# Altium project TKHTN.PrjPcb
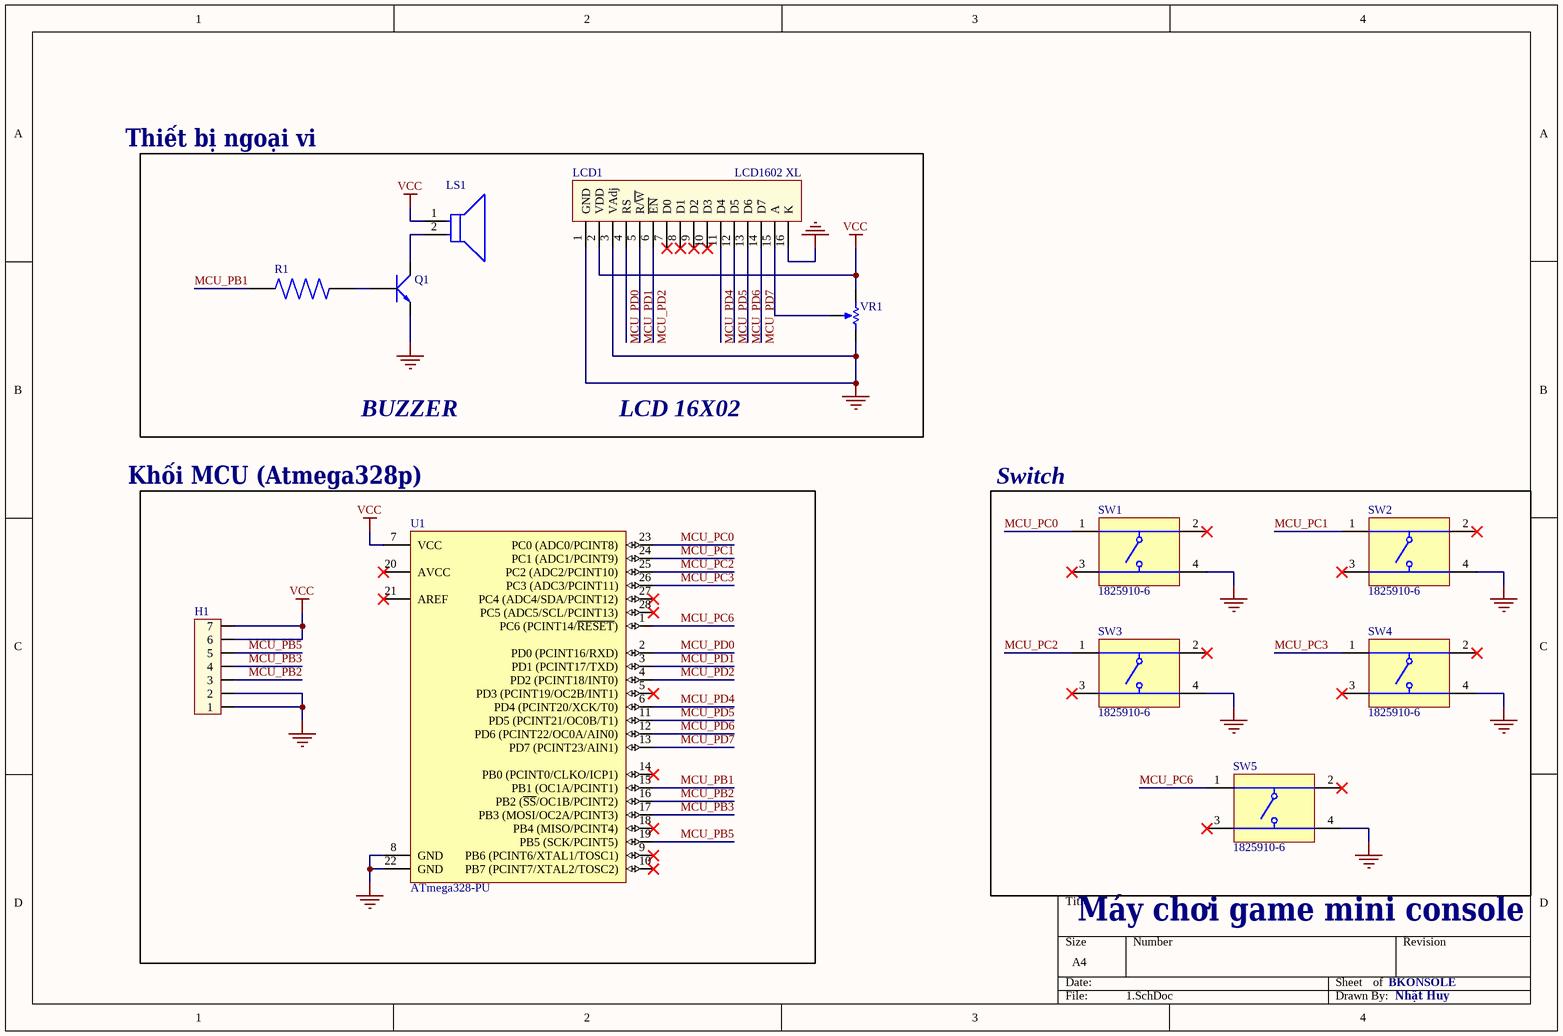
[diagram p0: 1.SchDoc]
1 sheet, 12 parts. Net scope: global (net labels, ports and power ports of the same name join across sheets).
Board file: 1.PcbDoc

## Sheet 1.SchDoc: Máy chơi game mini console
size A4; Author: BKONSOLE; DrawnBy: Nhật Huy; SheetNumber: 1; SheetTotal: 1

### Parts
H1  Header 7P 2.54 Duc Thang  [XH2.54M-7]  (value not drawn)
LCD1  LCD1602 XL  [LCD1602]
LS1  SD1614TT-A5ME  [FP-SD1614TT-A5ME-MFG]  (value not drawn)
Q1  C1815  [TO92]  (value not drawn)
R1  MFR-25FBF52-1K  [RESAD1100W55L680D260]  (value not drawn)
SW1  1825910-6  [TECO-1825910-6_V]
SW2  1825910-6  [TECO-1825910-6_V]
SW3  1825910-6  [TECO-1825910-6_V]
SW4  1825910-6  [TECO-1825910-6_V]
SW5  1825910-6  [TECO-1825910-6_V]
U1  ATmega328-PU  [28P3]
VR1  3006P-1-201ZLF  [BOUR-3006P-3_V]  (value not drawn)

### Blocks framed on the sheet
Khối MCU (Atmega328p): H1 U1
Switch: SW1-SW5

### Nets
GND: H1.1 H1.2 LCD1.1(GND) LCD1.3(VAdj) LCD1.16(K) Q1.1(E) SW1.4 SW2.4 SW3.4 SW4.4 SW5.4 U1.8(GND) U1.22(GND) VR1.1(CCW)
VCC: H1.6 H1.7 LCD1.2(VDD) LS1.1(C) U1.7(VCC) VR1.3(CW)
MCU_PB1: R1.1 U1.15(PB1_(OC1A/PCINT1))
MCU_PB2: H1.3 U1.16(PB2_(~{SS}/OC1B/PCINT2))
MCU_PB3: H1.4 U1.17(PB3_(MOSI/OC2A/PCINT3))
MCU_PB5: H1.5 U1.19(PB5_(SCK/PCINT5))
MCU_PC0: SW1.1 U1.23(PC0_(ADC0/PCINT8))
MCU_PC1: SW2.1 U1.24(PC1_(ADC1/PCINT9))
MCU_PC2: SW3.1 U1.25(PC2_(ADC2/PCINT10))
MCU_PC3: SW4.1 U1.26(PC3_(ADC3/PCINT11))
MCU_PC6: SW5.1 U1.1(PC6_(PCINT14/~{RESET}))
MCU_PD0: LCD1.4(RS) U1.2(PD0_(PCINT16/RXD))
MCU_PD1: LCD1.5(R/~{W}) U1.3(PD1_(PCINT17/TXD))
MCU_PD2: LCD1.6(~{EN}) U1.4(PD2_(PCINT18/INT0))
MCU_PD4: LCD1.11(D4) U1.6(PD4_(PCINT20/XCK/T0))
MCU_PD5: LCD1.12(D5) U1.11(PD5_(PCINT21/OC0B/T1))
MCU_PD6: LCD1.13(D6) U1.12(PD6_(PCINT22/OC0A/AIN0))
MCU_PD7: LCD1.14(D7) U1.13(PD7_(PCINT23/AIN1))
NetLCD1_15: LCD1.15(A) VR1.2(WIPER)
NetLS1_2: LS1.2(A) Q1.2(C)
NetQ1_3: Q1.3(B) R1.2

Not connected (* = marked no-connect by the designer): LCD1 7(D0)* 8(D1)* 9(D2)* 10(D3)*; SW1 2* 3*; SW2 2* 3*; SW3 2* 3*; SW4 2* 3*; SW5 2* 3*; U1 5(PD3_(PCINT19/OC2B/INT1))* 9(PB6_(PCINT6/XTAL1/TOSC1))* 10(PB7_(PCINT7/XTAL2/TOSC2))* 14(PB0_(PCINT0/CLKO/ICP1))* 18(PB4_(MISO/PCINT4))* 20(AVCC)* 21(AREF)* 27(PC4_(ADC4/SDA/PCINT12))* 28(PC5_(ADC5/SCL/PCINT13))*

### Notes on the sheet
- Thiết bị ngoại vi
- BUZZER
- LCD 16X02

### Library data of the parts
H1 = Header 7P 2.54 Duc Thang: Cắm; Ten_Linh_Kien: Header 7P XH2.54-7P Đực Thẳng; Don_Vi: Con; Ma_Hang: MH003369; Chung_Loai: Cắm
LCD1 = LCD1602 XL: LCD 1602 Xanh Lá; Ten: Màn hình LCD 1602 Xanh Lá; Ma_Hang: 67HZ; NCC: NSHOP; CHIP: HD44780
LS1 = CMP-08413-000006-1: BUZZER MAGNETIC 5V 80DB 2048HZ 1
Q1 = C1815: NPN transistor; Value: C9014
R1 = MFR-25FBF52-1K: 1.07 kOhms Â±1% 0.25W, 1/4W Through Hole Resistor Axial - Metal Film; MF: Yageo; SnapEDA_Link: https://www.snapeda.com/parts/MFR-25FBF52-1K/Yageo/view-part/?ref=snap; Package: RADIAL-2 YAGEO; Value: *; MP: MFR-25FBF52-1K; Check_prices: https://www.snapeda.com/parts/MFR-25FBF52-1K/Yageo/view-part/?ref=eda
SW1-SW5 = CMP-1684-00021-1: Tact Switch, SPST-NO, 0.05 A, -35 to 85 degC, 4-Pin THD, RoHS, Bulk; Manufacturer: TE Connectivity; Maximum Contact Resistance: 100mOhm; Mechanical Life: 100000Cycles; Bushing Type: Unthreaded; Switch Configuration: OFF(ON); Maximum DC Voltage Rating: 24V; Contact Rating @ Voltage: 0.05A@24VDC; Actuator Color: Black; Body Orientation: Straight; Function: MomentaryContact; Illumination: N/R; Actuator Style: RoundButton; Actuator Material: PolybutyleneTerephthalate; Dielectric Strength: 500VAC; Pole Throw Configuration: SPST; Actuator Length: 1.4mm; Product Weight: N/A; Contact Material: CopperAlloy; Housing Material: N/A; Terminal Type: PCPins; Minimum Insulation Resistance: 100MOhm; Package Description: 4-Pin Through Hole Device, Body 5.99 x 5.99 mm, Pitch 6.5 mm; Part No: 1825910-6; Package Reference: THD; Base Material: N/A; Manufacturer URL: http://www.te.com; Contact Plating: Silver; RoHS: Yes; Datasheet Version: Rev. C9; Electrical Life: 100000Cycles; Maximum AC Voltage Rating: N/A; Thread Size: N/R; Operating Temperature: -35to85C; Mounting: ThroughHole; Dimension: 5.99x5mm; Datasheet URL: http://www.te.com/commerce/DocumentDelivery/DDEController?Action=showdoc&DocId=Customer+Drawing%7F1825910%7FC9%7Fpdf%7FEnglish%7FENG_CD_1825910_C9.pdf%7F1825910-6; Family: 1825910; Seal Location: N/A; Seal Description: N/A; Packaging: N/A
U1 = CMP-0095-00015-2: 8-bit AVR Microcontroller, 32KB Flash, 1KB EEPROM, 2KB SRAM, 28-pin PDIP, Industrial Grade (-40°C to 85°C); ComponentLink3Description: ATmega48A/48PA/88A/88PA/168A/168PA/328/328P Summary; RevisionNote: DatasheetVersion updated. URLs added.; DatasheetVersion: revD, May-2011; ComponentLink1URL: http://www.atmel.com/; PackageVersion: revB, Sep-2001; PackageDescription: 28-lead (0.300"/7.62mm Wide) Plastic Dual Inline Package (PDIP); PackageReference: 28P3; ComponentLink1Description: Manufacturer URL; ComponentLink2Description: ATmega48A/48PA/88A/88PA/168A/168PA/328/328P Datasheet; ComponentLink3URL: http://www.atmel.com/dyn/resources/prod_documents/8271S.pdf; ComponentLink2URL: http://www.atmel.com/dyn/resources/prod_documents/8271.pdf
VR1 = CMP-0975-00016-2: Trimming Potentiometer, 200 Ohm +/- 10%, -55 to 125 degC, 3-Pin 19.05 x 4.83 x 6.6 mm THD, RoHS; Manufacturer: Bourns; Number of Turns: 15; Resistance (Ohm): 200; Rotational Life: 200 Cycles; Resistance Tolerance: +/- 10%; PackageDescription: 3-Pin THD, Body 19.05 x 4.83 mm, Height 6.6 mm; ComponentLink1Description: Manufacturer URL; PackageVersion: Apr-14; ComponentLink1URL: http://www.bourns.com/; Mounting Technology: Through Hole; ComponentLink3Description: Package Specification; ComponentLink2URL: http://www.bourns.com/data/global/pdfs/3006.pdf; DatasheetVersion: Apr-14; ComponentLink2Description: Datasheet; ComponentLink3URL: http://www.bourns.com/data/global/pdfs/3006.pdf; Temperature Range: -55 to 125 degC; RoHS: TRUE; PackageReference: 3006P-3; PartNumber: 3006P-1-201ZLF